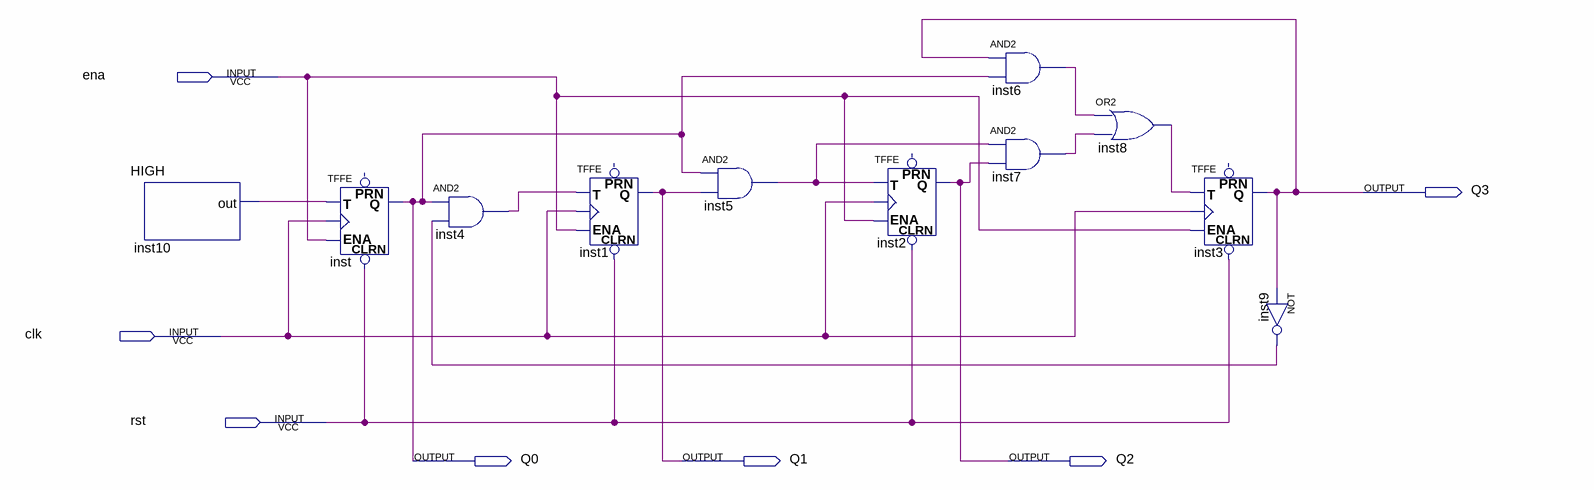
[diagram p0: schematic sheet]
// Quartus schematic decade_counter_ena.bdf as structural Verilog: 11 symbols, 7 pins
module decade_counter_ena (
  input  ena,
  input  clk,
  input  rst,
  output Q3,
  output Q0,
  output Q1,
  output Q2
);

  wire inst4_out, inst5_out, inst6_out, inst7_out, inst8_out, inst9_out, inst10_out;

  HIGH inst10 (.out(inst10_out));
  TFFE inst (.CLRN(rst), .T(inst10_out), .CLK(clk), .ENA(ena), .Q(Q0));  // open: PRN
  and inst4 (inst4_out, Q0, inst9_out);
  TFFE inst1 (.CLRN(rst), .T(inst4_out), .CLK(clk), .ENA(ena), .Q(Q1));  // open: PRN
  and inst5 (inst5_out, Q0, Q1);
  TFFE inst2 (.CLRN(rst), .T(inst5_out), .CLK(clk), .ENA(ena), .Q(Q2));  // open: PRN
  and inst6 (inst6_out, Q3, Q0);
  and inst7 (inst7_out, inst5_out, Q2);
  or inst8 (inst8_out, inst6_out, inst7_out);
  TFFE inst3 (.CLRN(rst), .T(inst8_out), .CLK(clk), .ENA(ena), .Q(Q3));  // open: PRN
  not inst9 (inst9_out, Q3);
endmodule
